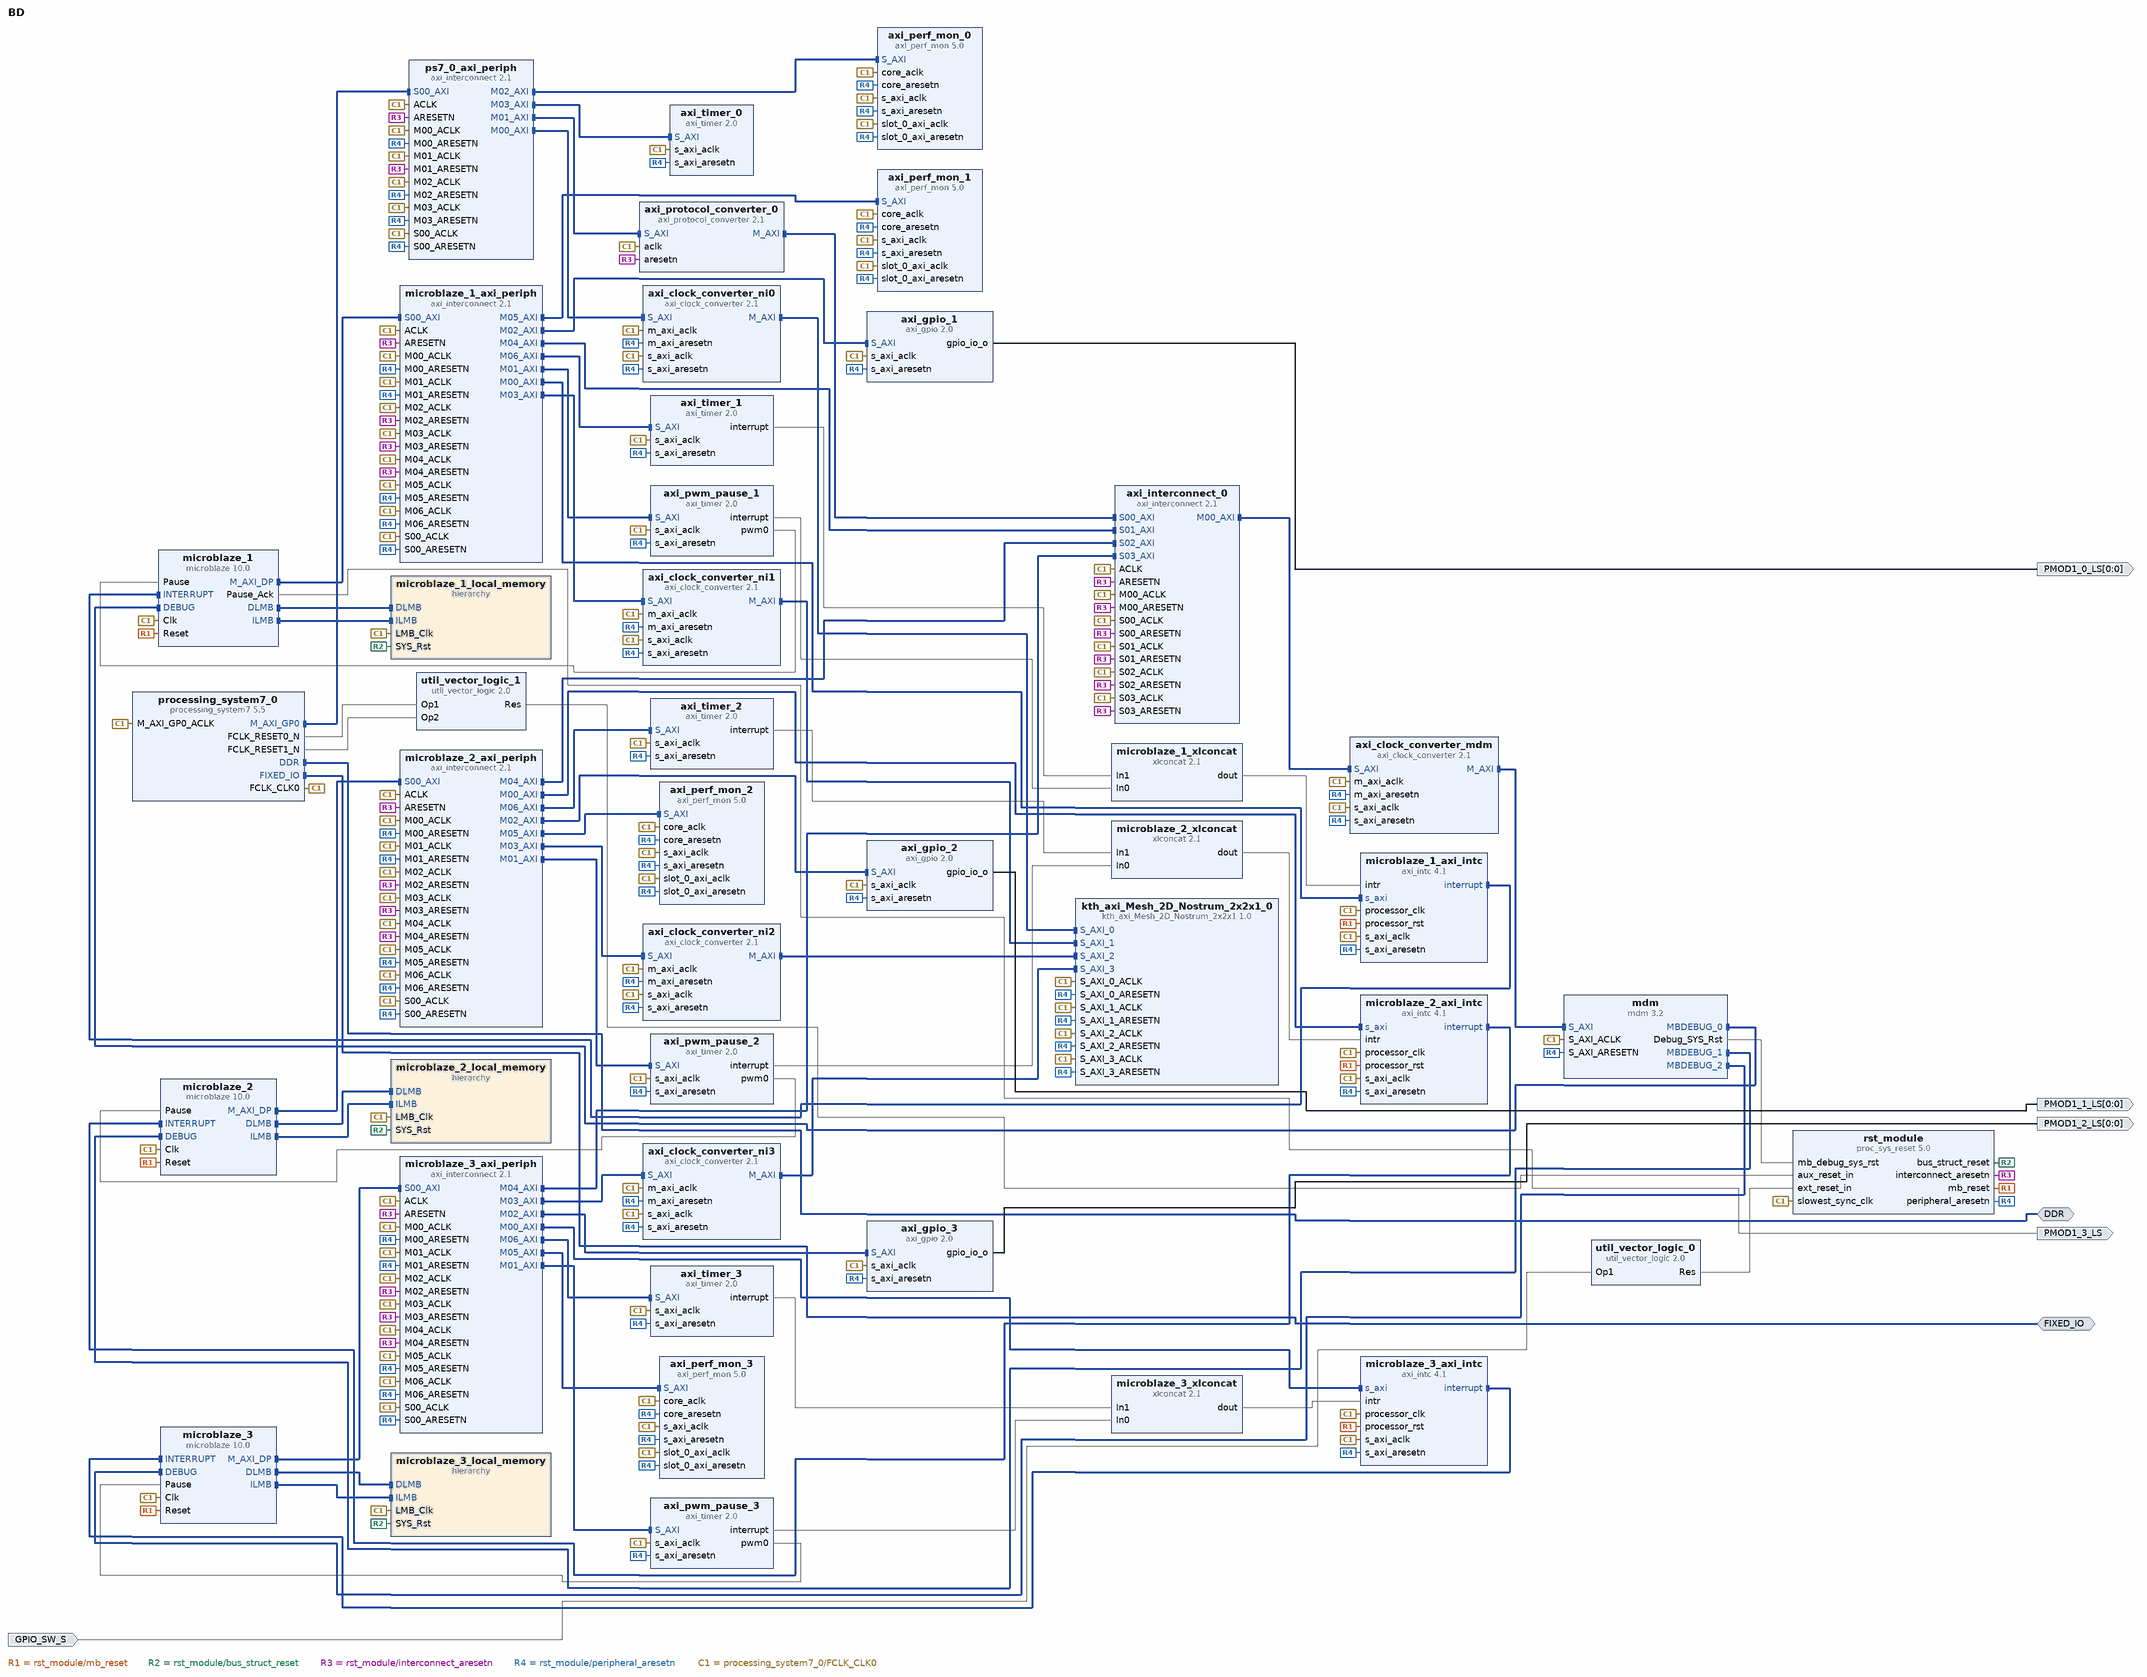
[diagram p0: block diagram of the top level]
# Vivado block design BD, xc7z020clg484-1, Vivado 2016.3
create_bd_design BD

create_bd_intf_port -mode Master -vlnv xilinx.com:interface:ddrx_rtl:1.0 DDR
create_bd_intf_port -mode Master -vlnv xilinx.com:display_processing_system7:fixedio_rtl:1.0 FIXED_IO
create_bd_port -dir O -from 0 -to 0 PMOD1_0_LS
create_bd_port -dir O -from 0 -to 0 PMOD1_1_LS
create_bd_port -dir O -from 0 -to 0 PMOD1_2_LS
create_bd_port -dir I GPIO_SW_S
create_bd_port -dir O PMOD1_3_LS

create_bd_cell -type ip -vlnv xilinx.com:ip:axi_gpio:2.0 axi_gpio_1
set_property -dict {CONFIG.C_GPIO_WIDTH 1 CONFIG.C_ALL_OUTPUTS 1} [get_bd_cells axi_gpio_1]
create_bd_cell -type ip -vlnv xilinx.com:ip:axi_gpio:2.0 axi_gpio_2
set_property -dict {CONFIG.C_GPIO_WIDTH 1 CONFIG.C_ALL_OUTPUTS 1} [get_bd_cells axi_gpio_2]
create_bd_cell -type ip -vlnv xilinx.com:ip:axi_gpio:2.0 axi_gpio_3
set_property -dict {CONFIG.C_GPIO_WIDTH 1 CONFIG.C_ALL_OUTPUTS 1} [get_bd_cells axi_gpio_3]
create_bd_cell -type ip -vlnv xilinx.com:ip:axi_timer:2.0 axi_pwm_pause_1
set_property -dict {CONFIG.mode_64bit 0} [get_bd_cells axi_pwm_pause_1]
create_bd_cell -type ip -vlnv xilinx.com:ip:axi_timer:2.0 axi_pwm_pause_2
set_property -dict {CONFIG.mode_64bit 0} [get_bd_cells axi_pwm_pause_2]
create_bd_cell -type ip -vlnv xilinx.com:ip:axi_timer:2.0 axi_pwm_pause_3
set_property -dict {CONFIG.mode_64bit 0} [get_bd_cells axi_pwm_pause_3]
create_bd_cell -type ip -vlnv xilinx.com:ip:microblaze:10.0 microblaze_1
set_property -dict [list \
  CONFIG.C_D_AXI 1 \
  CONFIG.C_D_LMB 1 \
  CONFIG.C_I_LMB 1 \
  CONFIG.C_ENABLE_DISCRETE_PORTS 1 \
  CONFIG.C_DEBUG_ENABLED 2 \
] [get_bd_cells microblaze_1]
create_bd_cell -type hier microblaze_1_local_memory
create_bd_cell -type ip -vlnv xilinx.com:ip:axi_interconnect:2.1 microblaze_1_axi_periph
set_property -dict {CONFIG.NUM_MI 7} [get_bd_cells microblaze_1_axi_periph]
create_bd_cell -type ip -vlnv xilinx.com:ip:axi_intc:4.1 microblaze_1_axi_intc
set_property -dict [list \
  CONFIG.C_HAS_FAST 1 \
  CONFIG.C_S_AXI_ACLK_FREQ_MHZ 100 \
  CONFIG.C_PROCESSOR_CLK_FREQ_MHZ 100 \
] [get_bd_cells microblaze_1_axi_intc]
create_bd_cell -type ip -vlnv xilinx.com:ip:xlconcat:2.1 microblaze_1_xlconcat
create_bd_cell -type ip -vlnv xilinx.com:ip:mdm:3.2 mdm
set_property -dict {CONFIG.C_MB_DBG_PORTS 3 CONFIG.C_USE_UART 1} [get_bd_cells mdm]
create_bd_cell -type ip -vlnv xilinx.com:ip:proc_sys_reset:5.0 rst_module
set_property -dict {CONFIG.C_AUX_RESET_HIGH 0} [get_bd_cells rst_module]
create_bd_cell -type ip -vlnv xilinx.com:ip:microblaze:10.0 microblaze_2
set_property -dict [list \
  CONFIG.C_D_AXI 1 \
  CONFIG.C_D_LMB 1 \
  CONFIG.C_I_LMB 1 \
  CONFIG.C_ENABLE_DISCRETE_PORTS 1 \
  CONFIG.C_DEBUG_ENABLED 2 \
] [get_bd_cells microblaze_2]
create_bd_cell -type hier microblaze_2_local_memory
create_bd_cell -type ip -vlnv xilinx.com:ip:axi_interconnect:2.1 microblaze_2_axi_periph
set_property -dict {CONFIG.NUM_MI 7} [get_bd_cells microblaze_2_axi_periph]
create_bd_cell -type ip -vlnv xilinx.com:ip:axi_intc:4.1 microblaze_2_axi_intc
set_property -dict [list \
  CONFIG.C_HAS_FAST 1 \
  CONFIG.C_S_AXI_ACLK_FREQ_MHZ 100 \
  CONFIG.C_PROCESSOR_CLK_FREQ_MHZ 100 \
] [get_bd_cells microblaze_2_axi_intc]
create_bd_cell -type ip -vlnv xilinx.com:ip:xlconcat:2.1 microblaze_2_xlconcat
create_bd_cell -type ip -vlnv xilinx.com:ip:microblaze:10.0 microblaze_3
set_property -dict [list \
  CONFIG.C_D_AXI 1 \
  CONFIG.C_D_LMB 1 \
  CONFIG.C_I_LMB 1 \
  CONFIG.C_ENABLE_DISCRETE_PORTS 1 \
  CONFIG.C_DEBUG_ENABLED 2 \
] [get_bd_cells microblaze_3]
create_bd_cell -type hier microblaze_3_local_memory
create_bd_cell -type ip -vlnv xilinx.com:ip:axi_interconnect:2.1 microblaze_3_axi_periph
set_property -dict {CONFIG.NUM_MI 7} [get_bd_cells microblaze_3_axi_periph]
create_bd_cell -type ip -vlnv xilinx.com:ip:axi_intc:4.1 microblaze_3_axi_intc
set_property -dict [list \
  CONFIG.C_HAS_FAST 1 \
  CONFIG.C_S_AXI_ACLK_FREQ_MHZ 100 \
  CONFIG.C_PROCESSOR_CLK_FREQ_MHZ 100 \
] [get_bd_cells microblaze_3_axi_intc]
create_bd_cell -type ip -vlnv xilinx.com:ip:xlconcat:2.1 microblaze_3_xlconcat
create_bd_cell -type ip -vlnv xilinx.com:ip:util_vector_logic:2.0 util_vector_logic_0
set_property -dict {CONFIG.C_SIZE 1 CONFIG.C_OPERATION not} [get_bd_cells util_vector_logic_0]
create_bd_cell -type ip -vlnv xilinx.com:ip:processing_system7:5.5 processing_system7_0
set_property -dict [list \
  CONFIG.PCW_FPGA0_PERIPHERAL_FREQMHZ 50 \
  CONFIG.PCW_FPGA1_PERIPHERAL_FREQMHZ 100 \
  CONFIG.PCW_EN_CLK1_PORT 1 \
  CONFIG.PCW_EN_CLK2_PORT 1 \
  CONFIG.PCW_EN_CLK3_PORT 1 \
  CONFIG.PCW_EN_RST1_PORT 1 \
  CONFIG.PCW_EN_RST2_PORT 1 \
  CONFIG.PCW_EN_RST3_PORT 1 \
  CONFIG.PCW_QSPI_GRP_SINGLE_SS_ENABLE 1 \
  CONFIG.PCW_USB0_PERIPHERAL_ENABLE 0 \
  CONFIG.preset ZC702 \
] [get_bd_cells processing_system7_0]
# 6 more settings of processing_system7_0 are not shown: defaults, MIO pin electricals, DDR timing, and values the tool derives
create_bd_cell -type ip -vlnv kth.se:tage:kth_axi_Mesh_2D_Nostrum_2x2x1:1.0 kth_axi_Mesh_2D_Nostrum_2x2x1_0
create_bd_cell -type ip -vlnv xilinx.com:ip:axi_interconnect:2.1 ps7_0_axi_periph
set_property -dict {CONFIG.NUM_MI 4} [get_bd_cells ps7_0_axi_periph]
create_bd_cell -type ip -vlnv xilinx.com:ip:axi_interconnect:2.1 axi_interconnect_0
set_property -dict [list \
  CONFIG.NUM_SI 4 \
  CONFIG.NUM_MI 1 \
  CONFIG.ENABLE_ADVANCED_OPTIONS 1 \
  CONFIG.M00_HAS_DATA_FIFO 1 \
  CONFIG.S00_HAS_REGSLICE 3 \
  CONFIG.S01_HAS_REGSLICE 3 \
  CONFIG.S02_HAS_REGSLICE 3 \
  CONFIG.S03_HAS_REGSLICE 3 \
  CONFIG.S00_HAS_DATA_FIFO 1 \
  CONFIG.S01_HAS_DATA_FIFO 1 \
  CONFIG.S02_HAS_DATA_FIFO 1 \
  CONFIG.S03_HAS_DATA_FIFO 1 \
] [get_bd_cells axi_interconnect_0]
create_bd_cell -type ip -vlnv xilinx.com:ip:axi_protocol_converter:2.1 axi_protocol_converter_0
create_bd_cell -type ip -vlnv xilinx.com:ip:axi_perf_mon:5.0 axi_perf_mon_0
set_property -dict [list \
  CONFIG.C_NUM_OF_COUNTERS 10 \
  CONFIG.C_ENABLE_EVENT_COUNT 1 \
  CONFIG.ENABLE_EXT_TRIGGERS 0 \
  CONFIG.C_ENABLE_ADVANCED 1 \
  CONFIG.C_ENABLE_PROFILE 0 \
] [get_bd_cells axi_perf_mon_0]
create_bd_cell -type ip -vlnv xilinx.com:ip:axi_perf_mon:5.0 axi_perf_mon_1
set_property -dict [list \
  CONFIG.C_NUM_OF_COUNTERS 10 \
  CONFIG.C_ENABLE_EVENT_COUNT 1 \
  CONFIG.ENABLE_EXT_TRIGGERS 0 \
  CONFIG.C_ENABLE_ADVANCED 1 \
  CONFIG.C_ENABLE_PROFILE 0 \
] [get_bd_cells axi_perf_mon_1]
create_bd_cell -type ip -vlnv xilinx.com:ip:axi_perf_mon:5.0 axi_perf_mon_2
set_property -dict [list \
  CONFIG.C_NUM_OF_COUNTERS 10 \
  CONFIG.C_ENABLE_EVENT_COUNT 1 \
  CONFIG.ENABLE_EXT_TRIGGERS 0 \
  CONFIG.C_ENABLE_ADVANCED 1 \
  CONFIG.C_ENABLE_PROFILE 0 \
] [get_bd_cells axi_perf_mon_2]
create_bd_cell -type ip -vlnv xilinx.com:ip:axi_perf_mon:5.0 axi_perf_mon_3
set_property -dict [list \
  CONFIG.C_NUM_OF_COUNTERS 10 \
  CONFIG.C_ENABLE_EVENT_COUNT 1 \
  CONFIG.ENABLE_EXT_TRIGGERS 0 \
  CONFIG.C_ENABLE_ADVANCED 1 \
  CONFIG.C_ENABLE_PROFILE 0 \
] [get_bd_cells axi_perf_mon_3]
create_bd_cell -type ip -vlnv xilinx.com:ip:axi_timer:2.0 axi_timer_0
create_bd_cell -type ip -vlnv xilinx.com:ip:axi_timer:2.0 axi_timer_1
create_bd_cell -type ip -vlnv xilinx.com:ip:axi_timer:2.0 axi_timer_2
create_bd_cell -type ip -vlnv xilinx.com:ip:axi_timer:2.0 axi_timer_3
create_bd_cell -type ip -vlnv xilinx.com:ip:axi_clock_converter:2.1 axi_clock_converter_mdm
set_property -dict {CONFIG.ACLK_ASYNC 1 CONFIG.SYNCHRONIZATION_STAGES 8} [get_bd_cells axi_clock_converter_mdm]
create_bd_cell -type ip -vlnv xilinx.com:ip:axi_clock_converter:2.1 axi_clock_converter_ni0
set_property -dict {CONFIG.ACLK_ASYNC 1 CONFIG.SYNCHRONIZATION_STAGES 8} [get_bd_cells axi_clock_converter_ni0]
create_bd_cell -type ip -vlnv xilinx.com:ip:axi_clock_converter:2.1 axi_clock_converter_ni1
set_property -dict {CONFIG.ACLK_ASYNC 1 CONFIG.SYNCHRONIZATION_STAGES 8} [get_bd_cells axi_clock_converter_ni1]
create_bd_cell -type ip -vlnv xilinx.com:ip:axi_clock_converter:2.1 axi_clock_converter_ni2
set_property -dict {CONFIG.ACLK_ASYNC 1 CONFIG.SYNCHRONIZATION_STAGES 8} [get_bd_cells axi_clock_converter_ni2]
create_bd_cell -type ip -vlnv xilinx.com:ip:axi_clock_converter:2.1 axi_clock_converter_ni3
set_property -dict {CONFIG.ACLK_ASYNC 1 CONFIG.SYNCHRONIZATION_STAGES 8} [get_bd_cells axi_clock_converter_ni3]
create_bd_cell -type ip -vlnv xilinx.com:ip:util_vector_logic:2.0 util_vector_logic_1
set_property -dict {CONFIG.C_OPERATION and} [get_bd_cells util_vector_logic_1]

# ---- hierarchy /microblaze_1_local_memory ----
current_bd_instance /microblaze_1_local_memory
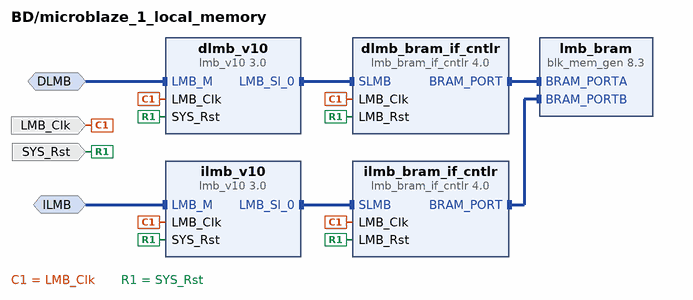
[diagram p1: block diagram inside /microblaze_1_local_memory]
create_bd_intf_pin -mode MirroredMaster -vlnv xilinx.com:interface:lmb_rtl:1.0 DLMB
create_bd_intf_pin -mode MirroredMaster -vlnv xilinx.com:interface:lmb_rtl:1.0 ILMB
create_bd_pin -dir I -type clk LMB_Clk
create_bd_pin -dir I -type rst SYS_Rst

create_bd_cell -type ip -vlnv xilinx.com:ip:lmb_v10:3.0 dlmb_v10
create_bd_cell -type ip -vlnv xilinx.com:ip:lmb_v10:3.0 ilmb_v10
create_bd_cell -type ip -vlnv xilinx.com:ip:lmb_bram_if_cntlr:4.0 dlmb_bram_if_cntlr
set_property -dict {CONFIG.C_ECC 0} [get_bd_cells dlmb_bram_if_cntlr]
create_bd_cell -type ip -vlnv xilinx.com:ip:lmb_bram_if_cntlr:4.0 ilmb_bram_if_cntlr
set_property -dict {CONFIG.C_ECC 0} [get_bd_cells ilmb_bram_if_cntlr]
create_bd_cell -type ip -vlnv xilinx.com:ip:blk_mem_gen:8.3 lmb_bram
set_property -dict {CONFIG.Memory_Type True_Dual_Port_RAM CONFIG.use_bram_block BRAM_Controller} [get_bd_cells lmb_bram]

# ---- hierarchy /microblaze_2_local_memory ----
current_bd_instance /microblaze_2_local_memory
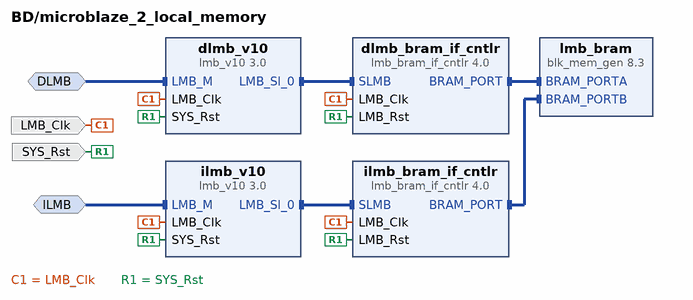
[diagram p2: block diagram inside /microblaze_2_local_memory]
create_bd_intf_pin -mode MirroredMaster -vlnv xilinx.com:interface:lmb_rtl:1.0 DLMB
create_bd_intf_pin -mode MirroredMaster -vlnv xilinx.com:interface:lmb_rtl:1.0 ILMB
create_bd_pin -dir I -type clk LMB_Clk
create_bd_pin -dir I -type rst SYS_Rst

create_bd_cell -type ip -vlnv xilinx.com:ip:lmb_v10:3.0 dlmb_v10
create_bd_cell -type ip -vlnv xilinx.com:ip:lmb_v10:3.0 ilmb_v10
create_bd_cell -type ip -vlnv xilinx.com:ip:lmb_bram_if_cntlr:4.0 dlmb_bram_if_cntlr
set_property -dict {CONFIG.C_ECC 0} [get_bd_cells dlmb_bram_if_cntlr]
create_bd_cell -type ip -vlnv xilinx.com:ip:lmb_bram_if_cntlr:4.0 ilmb_bram_if_cntlr
set_property -dict {CONFIG.C_ECC 0} [get_bd_cells ilmb_bram_if_cntlr]
create_bd_cell -type ip -vlnv xilinx.com:ip:blk_mem_gen:8.3 lmb_bram
set_property -dict {CONFIG.Memory_Type True_Dual_Port_RAM CONFIG.use_bram_block BRAM_Controller} [get_bd_cells lmb_bram]

# ---- hierarchy /microblaze_3_local_memory ----
current_bd_instance /microblaze_3_local_memory
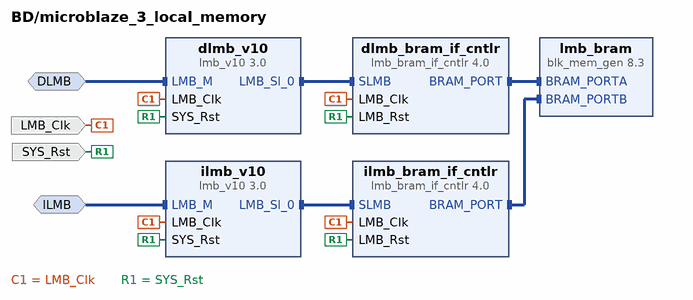
[diagram p3: block diagram inside /microblaze_3_local_memory]
create_bd_intf_pin -mode MirroredMaster -vlnv xilinx.com:interface:lmb_rtl:1.0 DLMB
create_bd_intf_pin -mode MirroredMaster -vlnv xilinx.com:interface:lmb_rtl:1.0 ILMB
create_bd_pin -dir I -type clk LMB_Clk
create_bd_pin -dir I -type rst SYS_Rst

create_bd_cell -type ip -vlnv xilinx.com:ip:lmb_v10:3.0 dlmb_v10
create_bd_cell -type ip -vlnv xilinx.com:ip:lmb_v10:3.0 ilmb_v10
create_bd_cell -type ip -vlnv xilinx.com:ip:lmb_bram_if_cntlr:4.0 dlmb_bram_if_cntlr
set_property -dict {CONFIG.C_ECC 0} [get_bd_cells dlmb_bram_if_cntlr]
create_bd_cell -type ip -vlnv xilinx.com:ip:lmb_bram_if_cntlr:4.0 ilmb_bram_if_cntlr
set_property -dict {CONFIG.C_ECC 0} [get_bd_cells ilmb_bram_if_cntlr]
create_bd_cell -type ip -vlnv xilinx.com:ip:blk_mem_gen:8.3 lmb_bram
set_property -dict {CONFIG.Memory_Type True_Dual_Port_RAM CONFIG.use_bram_block BRAM_Controller} [get_bd_cells lmb_bram]

# ---- connections ----

current_bd_instance /microblaze_1_local_memory
connect_bd_intf_net [get_bd_intf_pins dlmb_v10/LMB_Sl_0] [get_bd_intf_pins dlmb_bram_if_cntlr/SLMB]
connect_bd_intf_net [get_bd_intf_pins ilmb_v10/LMB_Sl_0] [get_bd_intf_pins ilmb_bram_if_cntlr/SLMB]
connect_bd_intf_net [get_bd_intf_pins dlmb_bram_if_cntlr/BRAM_PORT] [get_bd_intf_pins lmb_bram/BRAM_PORTA]
connect_bd_intf_net [get_bd_intf_pins ilmb_bram_if_cntlr/BRAM_PORT] [get_bd_intf_pins lmb_bram/BRAM_PORTB]
connect_bd_intf_net [get_bd_intf_pins DLMB] [get_bd_intf_pins dlmb_v10/LMB_M]
connect_bd_intf_net [get_bd_intf_pins ILMB] [get_bd_intf_pins ilmb_v10/LMB_M]
connect_bd_net -net microblaze_1_Clk [get_bd_pins LMB_Clk] \
  [get_bd_pins dlmb_v10/LMB_Clk] [get_bd_pins dlmb_bram_if_cntlr/LMB_Clk] [get_bd_pins ilmb_v10/LMB_Clk] \
  [get_bd_pins ilmb_bram_if_cntlr/LMB_Clk]
connect_bd_net [get_bd_pins SYS_Rst] \
  [get_bd_pins dlmb_v10/SYS_Rst] [get_bd_pins dlmb_bram_if_cntlr/LMB_Rst] [get_bd_pins ilmb_v10/SYS_Rst] \
  [get_bd_pins ilmb_bram_if_cntlr/LMB_Rst]

current_bd_instance /microblaze_2_local_memory
connect_bd_intf_net [get_bd_intf_pins dlmb_v10/LMB_Sl_0] [get_bd_intf_pins dlmb_bram_if_cntlr/SLMB]
connect_bd_intf_net [get_bd_intf_pins ilmb_v10/LMB_Sl_0] [get_bd_intf_pins ilmb_bram_if_cntlr/SLMB]
connect_bd_intf_net [get_bd_intf_pins dlmb_bram_if_cntlr/BRAM_PORT] [get_bd_intf_pins lmb_bram/BRAM_PORTA]
connect_bd_intf_net [get_bd_intf_pins ilmb_bram_if_cntlr/BRAM_PORT] [get_bd_intf_pins lmb_bram/BRAM_PORTB]
connect_bd_intf_net [get_bd_intf_pins DLMB] [get_bd_intf_pins dlmb_v10/LMB_M]
connect_bd_intf_net [get_bd_intf_pins ILMB] [get_bd_intf_pins ilmb_v10/LMB_M]
connect_bd_net -net microblaze_2_Clk [get_bd_pins LMB_Clk] \
  [get_bd_pins dlmb_v10/LMB_Clk] [get_bd_pins dlmb_bram_if_cntlr/LMB_Clk] [get_bd_pins ilmb_v10/LMB_Clk] \
  [get_bd_pins ilmb_bram_if_cntlr/LMB_Clk]
connect_bd_net [get_bd_pins SYS_Rst] \
  [get_bd_pins dlmb_v10/SYS_Rst] [get_bd_pins dlmb_bram_if_cntlr/LMB_Rst] [get_bd_pins ilmb_v10/SYS_Rst] \
  [get_bd_pins ilmb_bram_if_cntlr/LMB_Rst]

current_bd_instance /microblaze_3_local_memory
connect_bd_intf_net [get_bd_intf_pins dlmb_v10/LMB_Sl_0] [get_bd_intf_pins dlmb_bram_if_cntlr/SLMB]
connect_bd_intf_net [get_bd_intf_pins ilmb_v10/LMB_Sl_0] [get_bd_intf_pins ilmb_bram_if_cntlr/SLMB]
connect_bd_intf_net [get_bd_intf_pins dlmb_bram_if_cntlr/BRAM_PORT] [get_bd_intf_pins lmb_bram/BRAM_PORTA]
connect_bd_intf_net [get_bd_intf_pins ilmb_bram_if_cntlr/BRAM_PORT] [get_bd_intf_pins lmb_bram/BRAM_PORTB]
connect_bd_intf_net [get_bd_intf_pins DLMB] [get_bd_intf_pins dlmb_v10/LMB_M]
connect_bd_intf_net [get_bd_intf_pins ILMB] [get_bd_intf_pins ilmb_v10/LMB_M]
connect_bd_net -net microblaze_3_Clk [get_bd_pins LMB_Clk] \
  [get_bd_pins dlmb_v10/LMB_Clk] [get_bd_pins dlmb_bram_if_cntlr/LMB_Clk] [get_bd_pins ilmb_v10/LMB_Clk] \
  [get_bd_pins ilmb_bram_if_cntlr/LMB_Clk]
connect_bd_net [get_bd_pins SYS_Rst] \
  [get_bd_pins dlmb_v10/SYS_Rst] [get_bd_pins dlmb_bram_if_cntlr/LMB_Rst] [get_bd_pins ilmb_v10/SYS_Rst] \
  [get_bd_pins ilmb_bram_if_cntlr/LMB_Rst]

current_bd_instance /
connect_bd_intf_net [get_bd_intf_pins microblaze_1/DLMB] [get_bd_intf_pins microblaze_1_local_memory/DLMB]
connect_bd_intf_net [get_bd_intf_pins microblaze_1/ILMB] [get_bd_intf_pins microblaze_1_local_memory/ILMB]
connect_bd_intf_net [get_bd_intf_pins microblaze_1_axi_periph/S00_AXI] [get_bd_intf_pins microblaze_1/M_AXI_DP]
connect_bd_intf_net [get_bd_intf_pins microblaze_1_axi_intc/interrupt] [get_bd_intf_pins microblaze_1/INTERRUPT]
connect_bd_intf_net [get_bd_intf_pins microblaze_1_axi_periph/M00_AXI] [get_bd_intf_pins microblaze_1_axi_intc/s_axi]
connect_bd_intf_net [get_bd_intf_pins mdm/MBDEBUG_0] [get_bd_intf_pins microblaze_1/DEBUG]
connect_bd_intf_net [get_bd_intf_pins microblaze_2/DLMB] [get_bd_intf_pins microblaze_2_local_memory/DLMB]
connect_bd_intf_net [get_bd_intf_pins microblaze_2/ILMB] [get_bd_intf_pins microblaze_2_local_memory/ILMB]
connect_bd_intf_net [get_bd_intf_pins microblaze_2_axi_periph/S00_AXI] [get_bd_intf_pins microblaze_2/M_AXI_DP]
connect_bd_intf_net [get_bd_intf_pins microblaze_2_axi_intc/interrupt] [get_bd_intf_pins microblaze_2/INTERRUPT]
connect_bd_intf_net [get_bd_intf_pins microblaze_2_axi_periph/M00_AXI] [get_bd_intf_pins microblaze_2_axi_intc/s_axi]
connect_bd_intf_net [get_bd_intf_pins mdm/MBDEBUG_1] [get_bd_intf_pins microblaze_2/DEBUG]
connect_bd_intf_net [get_bd_intf_pins microblaze_3/DLMB] [get_bd_intf_pins microblaze_3_local_memory/DLMB]
connect_bd_intf_net [get_bd_intf_pins microblaze_3/ILMB] [get_bd_intf_pins microblaze_3_local_memory/ILMB]
connect_bd_intf_net [get_bd_intf_pins microblaze_3_axi_periph/S00_AXI] [get_bd_intf_pins microblaze_3/M_AXI_DP]
connect_bd_intf_net [get_bd_intf_pins microblaze_3_axi_intc/interrupt] [get_bd_intf_pins microblaze_3/INTERRUPT]
connect_bd_intf_net [get_bd_intf_pins microblaze_3_axi_periph/M00_AXI] [get_bd_intf_pins microblaze_3_axi_intc/s_axi]
connect_bd_intf_net [get_bd_intf_pins mdm/MBDEBUG_2] [get_bd_intf_pins microblaze_3/DEBUG]
connect_bd_intf_net [get_bd_intf_pins microblaze_1_axi_periph/M01_AXI] [get_bd_intf_pins axi_pwm_pause_1/S_AXI]
connect_bd_intf_net [get_bd_intf_pins microblaze_1_axi_periph/M02_AXI] [get_bd_intf_pins axi_gpio_1/S_AXI]
connect_bd_intf_net [get_bd_intf_pins microblaze_2_axi_periph/M01_AXI] [get_bd_intf_pins axi_pwm_pause_2/S_AXI]
connect_bd_intf_net [get_bd_intf_pins microblaze_2_axi_periph/M02_AXI] [get_bd_intf_pins axi_gpio_2/S_AXI]
connect_bd_intf_net [get_bd_intf_pins microblaze_3_axi_periph/M01_AXI] [get_bd_intf_pins axi_pwm_pause_3/S_AXI]
connect_bd_intf_net [get_bd_intf_pins microblaze_3_axi_periph/M02_AXI] [get_bd_intf_pins axi_gpio_3/S_AXI]
connect_bd_intf_net [get_bd_intf_pins processing_system7_0/M_AXI_GP0] [get_bd_intf_pins ps7_0_axi_periph/S00_AXI]
connect_bd_intf_net [get_bd_intf_pins ps7_0_axi_periph/M01_AXI] [get_bd_intf_pins axi_protocol_converter_0/S_AXI]
connect_bd_intf_net [get_bd_intf_pins axi_protocol_converter_0/M_AXI] [get_bd_intf_pins axi_interconnect_0/S00_AXI]
connect_bd_intf_net [get_bd_intf_pins microblaze_1_axi_periph/M04_AXI] [get_bd_intf_pins axi_interconnect_0/S01_AXI]
connect_bd_intf_net [get_bd_intf_pins microblaze_2_axi_periph/M04_AXI] [get_bd_intf_pins axi_interconnect_0/S02_AXI]
connect_bd_intf_net [get_bd_intf_pins microblaze_3_axi_periph/M04_AXI] [get_bd_intf_pins axi_interconnect_0/S03_AXI]
connect_bd_intf_net [get_bd_intf_pins ps7_0_axi_periph/M02_AXI] [get_bd_intf_pins axi_perf_mon_0/S_AXI]
connect_bd_intf_net [get_bd_intf_pins microblaze_1_axi_periph/M05_AXI] [get_bd_intf_pins axi_perf_mon_1/S_AXI]
connect_bd_intf_net [get_bd_intf_pins microblaze_2_axi_periph/M05_AXI] [get_bd_intf_pins axi_perf_mon_2/S_AXI]
connect_bd_intf_net [get_bd_intf_pins microblaze_3_axi_periph/M05_AXI] [get_bd_intf_pins axi_perf_mon_3/S_AXI]
connect_bd_intf_net [get_bd_intf_pins ps7_0_axi_periph/M03_AXI] [get_bd_intf_pins axi_timer_0/S_AXI]
connect_bd_intf_net [get_bd_intf_pins microblaze_1_axi_periph/M06_AXI] [get_bd_intf_pins axi_timer_1/S_AXI]
connect_bd_intf_net [get_bd_intf_pins microblaze_2_axi_periph/M06_AXI] [get_bd_intf_pins axi_timer_2/S_AXI]
connect_bd_intf_net [get_bd_intf_pins microblaze_3_axi_periph/M06_AXI] [get_bd_intf_pins axi_timer_3/S_AXI]
connect_bd_intf_net [get_bd_intf_pins axi_interconnect_0/M00_AXI] [get_bd_intf_pins axi_clock_converter_mdm/S_AXI]
connect_bd_intf_net [get_bd_intf_pins ps7_0_axi_periph/M00_AXI] [get_bd_intf_pins axi_clock_converter_ni0/S_AXI]
connect_bd_intf_net [get_bd_intf_pins microblaze_1_axi_periph/M03_AXI] [get_bd_intf_pins axi_clock_converter_ni1/S_AXI]
connect_bd_intf_net [get_bd_intf_pins microblaze_2_axi_periph/M03_AXI] [get_bd_intf_pins axi_clock_converter_ni2/S_AXI]
connect_bd_intf_net [get_bd_intf_pins microblaze_3_axi_periph/M03_AXI] [get_bd_intf_pins axi_clock_converter_ni3/S_AXI]
connect_bd_intf_net [get_bd_intf_pins axi_clock_converter_mdm/M_AXI] [get_bd_intf_pins mdm/S_AXI]
connect_bd_intf_net [get_bd_intf_pins axi_clock_converter_ni0/M_AXI] [get_bd_intf_pins kth_axi_Mesh_2D_Nostrum_2x2x1_0/S_AXI_0]
connect_bd_intf_net [get_bd_intf_pins axi_clock_converter_ni1/M_AXI] [get_bd_intf_pins kth_axi_Mesh_2D_Nostrum_2x2x1_0/S_AXI_1]
connect_bd_intf_net [get_bd_intf_pins axi_clock_converter_ni2/M_AXI] [get_bd_intf_pins kth_axi_Mesh_2D_Nostrum_2x2x1_0/S_AXI_2]
connect_bd_intf_net [get_bd_intf_pins axi_clock_converter_ni3/M_AXI] [get_bd_intf_pins kth_axi_Mesh_2D_Nostrum_2x2x1_0/S_AXI_3]
connect_bd_intf_net [get_bd_intf_ports DDR] [get_bd_intf_pins processing_system7_0/DDR]
connect_bd_intf_net [get_bd_intf_ports FIXED_IO] [get_bd_intf_pins processing_system7_0/FIXED_IO]
connect_bd_net [get_bd_pins axi_gpio_1/gpio_io_o] [get_bd_ports PMOD1_0_LS]
connect_bd_net [get_bd_pins axi_gpio_2/gpio_io_o] [get_bd_ports PMOD1_1_LS]
connect_bd_net [get_bd_pins axi_gpio_3/gpio_io_o] [get_bd_ports PMOD1_2_LS]
connect_bd_net -net microblaze_1_intr [get_bd_pins microblaze_1_xlconcat/dout] [get_bd_pins microblaze_1_axi_intc/intr]
connect_bd_net -net rst_clk_wiz_0_100M_mb_reset [get_bd_pins rst_module/mb_reset] \
  [get_bd_pins microblaze_1/Reset] [get_bd_pins microblaze_1_axi_intc/processor_rst] [get_bd_pins microblaze_2/Reset] \
  [get_bd_pins microblaze_2_axi_intc/processor_rst] [get_bd_pins microblaze_3/Reset] \
  [get_bd_pins microblaze_3_axi_intc/processor_rst]
connect_bd_net -net rst_clk_wiz_0_100M_bus_struct_reset [get_bd_pins rst_module/bus_struct_reset] \
  [get_bd_pins microblaze_1_local_memory/SYS_Rst] [get_bd_pins microblaze_2_local_memory/SYS_Rst] \
  [get_bd_pins microblaze_3_local_memory/SYS_Rst]
connect_bd_net -net rst_clk_wiz_0_100M_interconnect_aresetn [get_bd_pins rst_module/interconnect_aresetn] \
  [get_bd_pins microblaze_1_axi_periph/ARESETN] [get_bd_pins microblaze_2_axi_periph/ARESETN] \
  [get_bd_pins microblaze_3_axi_periph/ARESETN] [get_bd_pins microblaze_1_axi_periph/M02_ARESETN] \
  [get_bd_pins microblaze_1_axi_periph/M03_ARESETN] [get_bd_pins microblaze_2_axi_periph/M02_ARESETN] \
  [get_bd_pins microblaze_2_axi_periph/M03_ARESETN] [get_bd_pins microblaze_3_axi_periph/M02_ARESETN] \
  [get_bd_pins microblaze_3_axi_periph/M03_ARESETN] [get_bd_pins ps7_0_axi_periph/ARESETN] \
  [get_bd_pins ps7_0_axi_periph/M01_ARESETN] [get_bd_pins axi_protocol_converter_0/aresetn] \
  [get_bd_pins microblaze_1_axi_periph/M04_ARESETN] [get_bd_pins microblaze_2_axi_periph/M04_ARESETN] \
  [get_bd_pins microblaze_3_axi_periph/M04_ARESETN] [get_bd_pins axi_interconnect_0/ARESETN] \
  [get_bd_pins axi_interconnect_0/S00_ARESETN] [get_bd_pins axi_interconnect_0/S01_ARESETN] \
  [get_bd_pins axi_interconnect_0/S02_ARESETN] [get_bd_pins axi_interconnect_0/S03_ARESETN] \
  [get_bd_pins axi_interconnect_0/M00_ARESETN]
connect_bd_net -net rst_clk_wiz_0_100M_peripheral_aresetn [get_bd_pins rst_module/peripheral_aresetn] \
  [get_bd_pins microblaze_1_axi_periph/S00_ARESETN] [get_bd_pins microblaze_1_axi_periph/M00_ARESETN] \
  [get_bd_pins microblaze_1_axi_intc/s_axi_aresetn] [get_bd_pins microblaze_2_axi_periph/S00_ARESETN] \
  [get_bd_pins microblaze_2_axi_periph/M00_ARESETN] [get_bd_pins microblaze_2_axi_intc/s_axi_aresetn] \
  [get_bd_pins microblaze_3_axi_periph/S00_ARESETN] [get_bd_pins microblaze_3_axi_periph/M00_ARESETN] \
  [get_bd_pins microblaze_3_axi_intc/s_axi_aresetn] [get_bd_pins axi_pwm_pause_1/s_axi_aresetn] \
  [get_bd_pins microblaze_1_axi_periph/M01_ARESETN] [get_bd_pins axi_gpio_1/s_axi_aresetn] \
  [get_bd_pins kth_axi_Mesh_2D_Nostrum_2x2x1_0/S_AXI_1_ARESETN] [get_bd_pins axi_pwm_pause_2/s_axi_aresetn] \
  [get_bd_pins microblaze_2_axi_periph/M01_ARESETN] [get_bd_pins axi_gpio_2/s_axi_aresetn] \
  [get_bd_pins kth_axi_Mesh_2D_Nostrum_2x2x1_0/S_AXI_2_ARESETN] [get_bd_pins axi_pwm_pause_3/s_axi_aresetn] \
  [get_bd_pins microblaze_3_axi_periph/M01_ARESETN] [get_bd_pins axi_gpio_3/s_axi_aresetn] \
  [get_bd_pins kth_axi_Mesh_2D_Nostrum_2x2x1_0/S_AXI_3_ARESETN] [get_bd_pins ps7_0_axi_periph/S00_ARESETN] \
  [get_bd_pins kth_axi_Mesh_2D_Nostrum_2x2x1_0/S_AXI_0_ARESETN] [get_bd_pins ps7_0_axi_periph/M00_ARESETN] \
  [get_bd_pins mdm/S_AXI_ARESETN] [get_bd_pins axi_perf_mon_0/s_axi_aresetn] [get_bd_pins ps7_0_axi_periph/M02_ARESETN] \
  [get_bd_pins axi_perf_mon_1/s_axi_aresetn] [get_bd_pins microblaze_1_axi_periph/M05_ARESETN] \
  [get_bd_pins axi_perf_mon_2/s_axi_aresetn] [get_bd_pins microblaze_2_axi_periph/M05_ARESETN] \
  [get_bd_pins axi_perf_mon_3/s_axi_aresetn] [get_bd_pins microblaze_3_axi_periph/M05_ARESETN] \
  [get_bd_pins axi_perf_mon_0/core_aresetn] [get_bd_pins axi_perf_mon_0/slot_0_axi_aresetn] \
  [get_bd_pins axi_perf_mon_1/core_aresetn] [get_bd_pins axi_perf_mon_1/slot_0_axi_aresetn] \
  [get_bd_pins axi_perf_mon_2/core_aresetn] [get_bd_pins axi_perf_mon_2/slot_0_axi_aresetn] \
  [get_bd_pins axi_perf_mon_3/core_aresetn] [get_bd_pins axi_perf_mon_3/slot_0_axi_aresetn] \
  [get_bd_pins axi_timer_0/s_axi_aresetn] [get_bd_pins ps7_0_axi_periph/M03_ARESETN] [get_bd_pins axi_timer_1/s_axi_aresetn] \
  [get_bd_pins microblaze_1_axi_periph/M06_ARESETN] [get_bd_pins axi_timer_2/s_axi_aresetn] \
  [get_bd_pins microblaze_2_axi_periph/M06_ARESETN] [get_bd_pins axi_timer_3/s_axi_aresetn] \
  [get_bd_pins microblaze_3_axi_periph/M06_ARESETN] [get_bd_pins axi_clock_converter_mdm/s_axi_aresetn] \
  [get_bd_pins axi_clock_converter_ni0/s_axi_aresetn] [get_bd_pins axi_clock_converter_ni1/s_axi_aresetn] \
  [get_bd_pins axi_clock_converter_ni2/s_axi_aresetn] [get_bd_pins axi_clock_converter_ni3/s_axi_aresetn] \
  [get_bd_pins axi_clock_converter_mdm/m_axi_aresetn] [get_bd_pins axi_clock_converter_ni0/m_axi_aresetn] \
  [get_bd_pins axi_clock_converter_ni1/m_axi_aresetn] [get_bd_pins axi_clock_converter_ni2/m_axi_aresetn] \
  [get_bd_pins axi_clock_converter_ni3/m_axi_aresetn]
connect_bd_net -net mdm_1_debug_sys_rst [get_bd_pins mdm/Debug_SYS_Rst] [get_bd_pins rst_module/mb_debug_sys_rst]
connect_bd_net -net microblaze_2_intr [get_bd_pins microblaze_2_xlconcat/dout] [get_bd_pins microblaze_2_axi_intc/intr]
connect_bd_net -net microblaze_3_intr [get_bd_pins microblaze_3_xlconcat/dout] [get_bd_pins microblaze_3_axi_intc/intr]
connect_bd_net [get_bd_ports GPIO_SW_S] [get_bd_pins util_vector_logic_0/Op1]
connect_bd_net [get_bd_pins util_vector_logic_0/Res] [get_bd_pins rst_module/ext_reset_in]
connect_bd_net [get_bd_pins axi_pwm_pause_1/interrupt] [get_bd_pins microblaze_1_xlconcat/In0]
connect_bd_net [get_bd_pins axi_pwm_pause_2/interrupt] [get_bd_pins microblaze_2_xlconcat/In0]
connect_bd_net [get_bd_pins axi_pwm_pause_3/interrupt] [get_bd_pins microblaze_3_xlconcat/In0]
connect_bd_net [get_bd_pins axi_pwm_pause_1/pwm0] [get_bd_pins microblaze_1/Pause]
connect_bd_net [get_bd_pins axi_pwm_pause_2/pwm0] [get_bd_pins microblaze_2/Pause]
connect_bd_net [get_bd_pins axi_pwm_pause_3/pwm0] [get_bd_pins microblaze_3/Pause]
connect_bd_net [get_bd_pins microblaze_1/Pause_Ack] [get_bd_ports PMOD1_3_LS]
connect_bd_net [get_bd_pins axi_timer_1/interrupt] [get_bd_pins microblaze_1_xlconcat/In1]
connect_bd_net [get_bd_pins axi_timer_2/interrupt] [get_bd_pins microblaze_2_xlconcat/In1]
connect_bd_net [get_bd_pins axi_timer_3/interrupt] [get_bd_pins microblaze_3_xlconcat/In1]
connect_bd_net [get_bd_pins processing_system7_0/FCLK_CLK0] \
  [get_bd_pins rst_module/slowest_sync_clk] [get_bd_pins mdm/S_AXI_ACLK] \
  [get_bd_pins kth_axi_Mesh_2D_Nostrum_2x2x1_0/S_AXI_0_ACLK] [get_bd_pins kth_axi_Mesh_2D_Nostrum_2x2x1_0/S_AXI_1_ACLK] \
  [get_bd_pins kth_axi_Mesh_2D_Nostrum_2x2x1_0/S_AXI_2_ACLK] [get_bd_pins kth_axi_Mesh_2D_Nostrum_2x2x1_0/S_AXI_3_ACLK] \
  [get_bd_pins axi_clock_converter_mdm/m_axi_aclk] [get_bd_pins axi_clock_converter_ni0/m_axi_aclk] \
  [get_bd_pins axi_clock_converter_ni1/m_axi_aclk] [get_bd_pins axi_clock_converter_ni2/m_axi_aclk] \
  [get_bd_pins axi_clock_converter_ni3/m_axi_aclk] [get_bd_pins microblaze_1/Clk] [get_bd_pins microblaze_1_axi_periph/ACLK] \
  [get_bd_pins microblaze_1_axi_periph/S00_ACLK] [get_bd_pins microblaze_1_axi_periph/M00_ACLK] \
  [get_bd_pins microblaze_1_axi_intc/s_axi_aclk] [get_bd_pins microblaze_1_axi_intc/processor_clk] \
  [get_bd_pins microblaze_1_local_memory/LMB_Clk] [get_bd_pins microblaze_2/Clk] [get_bd_pins microblaze_2_axi_periph/ACLK] \
  [get_bd_pins microblaze_2_axi_periph/S00_ACLK] [get_bd_pins microblaze_2_axi_periph/M00_ACLK] \
  [get_bd_pins microblaze_2_axi_intc/s_axi_aclk] [get_bd_pins microblaze_2_axi_intc/processor_clk] \
  [get_bd_pins microblaze_2_local_memory/LMB_Clk] [get_bd_pins microblaze_3/Clk] [get_bd_pins microblaze_3_axi_periph/ACLK] \
  [get_bd_pins microblaze_3_axi_periph/S00_ACLK] [get_bd_pins microblaze_3_axi_periph/M00_ACLK] \
  [get_bd_pins microblaze_3_axi_intc/s_axi_aclk] [get_bd_pins microblaze_3_axi_intc/processor_clk] \
  [get_bd_pins microblaze_3_local_memory/LMB_Clk] [get_bd_pins axi_pwm_pause_1/s_axi_aclk] \
  [get_bd_pins microblaze_1_axi_periph/M01_ACLK] [get_bd_pins microblaze_1_axi_periph/M02_ACLK] \
  [get_bd_pins axi_gpio_1/s_axi_aclk] [get_bd_pins microblaze_1_axi_periph/M03_ACLK] [get_bd_pins axi_pwm_pause_2/s_axi_aclk] \
  [get_bd_pins microblaze_2_axi_periph/M01_ACLK] [get_bd_pins microblaze_2_axi_periph/M02_ACLK] \
  [get_bd_pins axi_gpio_2/s_axi_aclk] [get_bd_pins microblaze_2_axi_periph/M03_ACLK] [get_bd_pins axi_pwm_pause_3/s_axi_aclk] \
  [get_bd_pins microblaze_3_axi_periph/M01_ACLK] [get_bd_pins microblaze_3_axi_periph/M02_ACLK] \
  [get_bd_pins axi_gpio_3/s_axi_aclk] [get_bd_pins microblaze_3_axi_periph/M03_ACLK] \
  [get_bd_pins processing_system7_0/M_AXI_GP0_ACLK] [get_bd_pins ps7_0_axi_periph/S00_ACLK] \
  [get_bd_pins ps7_0_axi_periph/ACLK] [get_bd_pins ps7_0_axi_periph/M00_ACLK] [get_bd_pins ps7_0_axi_periph/M01_ACLK] \
  [get_bd_pins axi_protocol_converter_0/aclk] [get_bd_pins microblaze_1_axi_periph/M04_ACLK] \
  [get_bd_pins microblaze_2_axi_periph/M04_ACLK] [get_bd_pins microblaze_3_axi_periph/M04_ACLK] \
  [get_bd_pins axi_interconnect_0/ACLK] [get_bd_pins axi_interconnect_0/S00_ACLK] [get_bd_pins axi_interconnect_0/S01_ACLK] \
  [get_bd_pins axi_interconnect_0/S02_ACLK] [get_bd_pins axi_interconnect_0/S03_ACLK] \
  [get_bd_pins axi_interconnect_0/M00_ACLK] [get_bd_pins axi_perf_mon_0/s_axi_aclk] [get_bd_pins ps7_0_axi_periph/M02_ACLK] \
  [get_bd_pins axi_perf_mon_1/s_axi_aclk] [get_bd_pins microblaze_1_axi_periph/M05_ACLK] \
  [get_bd_pins axi_perf_mon_2/s_axi_aclk] [get_bd_pins microblaze_2_axi_periph/M05_ACLK] \
  [get_bd_pins axi_perf_mon_3/s_axi_aclk] [get_bd_pins microblaze_3_axi_periph/M05_ACLK] \
  [get_bd_pins axi_perf_mon_0/slot_0_axi_aclk] [get_bd_pins axi_perf_mon_0/core_aclk] \
  [get_bd_pins axi_perf_mon_1/slot_0_axi_aclk] [get_bd_pins axi_perf_mon_1/core_aclk] \
  [get_bd_pins axi_perf_mon_2/slot_0_axi_aclk] [get_bd_pins axi_perf_mon_2/core_aclk] \
  [get_bd_pins axi_perf_mon_3/slot_0_axi_aclk] [get_bd_pins axi_perf_mon_3/core_aclk] [get_bd_pins axi_timer_0/s_axi_aclk] \
  [get_bd_pins ps7_0_axi_periph/M03_ACLK] [get_bd_pins axi_timer_1/s_axi_aclk] [get_bd_pins microblaze_1_axi_periph/M06_ACLK] \
  [get_bd_pins axi_timer_2/s_axi_aclk] [get_bd_pins microblaze_2_axi_periph/M06_ACLK] [get_bd_pins axi_timer_3/s_axi_aclk] \
  [get_bd_pins microblaze_3_axi_periph/M06_ACLK] [get_bd_pins axi_clock_converter_mdm/s_axi_aclk] \
  [get_bd_pins axi_clock_converter_ni0/s_axi_aclk] [get_bd_pins axi_clock_converter_ni1/s_axi_aclk] \
  [get_bd_pins axi_clock_converter_ni2/s_axi_aclk] [get_bd_pins axi_clock_converter_ni3/s_axi_aclk]
connect_bd_net [get_bd_pins processing_system7_0/FCLK_RESET0_N] [get_bd_pins util_vector_logic_1/Op1]
connect_bd_net [get_bd_pins processing_system7_0/FCLK_RESET1_N] [get_bd_pins util_vector_logic_1/Op2]
connect_bd_net [get_bd_pins util_vector_logic_1/Res] [get_bd_pins rst_module/aux_reset_in]

# ---- address map ----
assign_bd_address -offset 0x00000000 -range 128K -target_address_space [get_bd_addr_spaces microblaze_1/Data] [get_bd_addr_segs microblaze_1_local_memory/dlmb_bram_if_cntlr/SLMB/Mem]
assign_bd_address -offset 0x40000000 -range 64K -target_address_space [get_bd_addr_spaces microblaze_1/Data] [get_bd_addr_segs axi_gpio_1/S_AXI/Reg]
assign_bd_address -offset 0x41200000 -range 64K -target_address_space [get_bd_addr_spaces microblaze_1/Data] [get_bd_addr_segs microblaze_1_axi_intc/S_AXI/Reg]
assign_bd_address -offset 0x41C00000 -range 64K -target_address_space [get_bd_addr_spaces microblaze_1/Data] [get_bd_addr_segs axi_pwm_pause_1/S_AXI/Reg]
assign_bd_address -offset 0x41C10000 -range 64K -target_address_space [get_bd_addr_spaces microblaze_1/Data] [get_bd_addr_segs axi_timer_1/S_AXI/Reg]
assign_bd_address -offset 0x43400000 -range 4K -target_address_space [get_bd_addr_spaces microblaze_1/Data] [get_bd_addr_segs mdm/S_AXI/Reg]
assign_bd_address -offset 0x44A00000 -range 64K -target_address_space [get_bd_addr_spaces microblaze_1/Data] [get_bd_addr_segs axi_perf_mon_1/S_AXI/Reg]
assign_bd_address -offset 0x70020000 -range 128K -target_address_space [get_bd_addr_spaces microblaze_1/Data] [get_bd_addr_segs kth_axi_Mesh_2D_Nostrum_2x2x1_0/S_AXI_1/reg0]
assign_bd_address -offset 0x00000000 -range 128K -target_address_space [get_bd_addr_spaces microblaze_1/Instruction] [get_bd_addr_segs microblaze_1_local_memory/ilmb_bram_if_cntlr/SLMB/Mem]
assign_bd_address -offset 0x00000000 -range 128K -target_address_space [get_bd_addr_spaces microblaze_2/Data] [get_bd_addr_segs microblaze_2_local_memory/dlmb_bram_if_cntlr/SLMB/Mem]
assign_bd_address -offset 0x40000000 -range 64K -target_address_space [get_bd_addr_spaces microblaze_2/Data] [get_bd_addr_segs axi_gpio_2/S_AXI/Reg]
assign_bd_address -offset 0x41200000 -range 64K -target_address_space [get_bd_addr_spaces microblaze_2/Data] [get_bd_addr_segs microblaze_2_axi_intc/S_AXI/Reg]
assign_bd_address -offset 0x41C00000 -range 64K -target_address_space [get_bd_addr_spaces microblaze_2/Data] [get_bd_addr_segs axi_pwm_pause_2/S_AXI/Reg]
assign_bd_address -offset 0x41C20000 -range 64K -target_address_space [get_bd_addr_spaces microblaze_2/Data] [get_bd_addr_segs axi_timer_2/S_AXI/Reg]
assign_bd_address -offset 0x43400000 -range 4K -target_address_space [get_bd_addr_spaces microblaze_2/Data] [get_bd_addr_segs mdm/S_AXI/Reg]
assign_bd_address -offset 0x44A10000 -range 64K -target_address_space [get_bd_addr_spaces microblaze_2/Data] [get_bd_addr_segs axi_perf_mon_2/S_AXI/Reg]
assign_bd_address -offset 0x70020000 -range 128K -target_address_space [get_bd_addr_spaces microblaze_2/Data] [get_bd_addr_segs kth_axi_Mesh_2D_Nostrum_2x2x1_0/S_AXI_2/reg0]
assign_bd_address -offset 0x00000000 -range 128K -target_address_space [get_bd_addr_spaces microblaze_2/Instruction] [get_bd_addr_segs microblaze_2_local_memory/ilmb_bram_if_cntlr/SLMB/Mem]
assign_bd_address -offset 0x00000000 -range 128K -target_address_space [get_bd_addr_spaces microblaze_3/Data] [get_bd_addr_segs microblaze_3_local_memory/dlmb_bram_if_cntlr/SLMB/Mem]
assign_bd_address -offset 0x40000000 -range 64K -target_address_space [get_bd_addr_spaces microblaze_3/Data] [get_bd_addr_segs axi_gpio_3/S_AXI/Reg]
assign_bd_address -offset 0x41200000 -range 64K -target_address_space [get_bd_addr_spaces microblaze_3/Data] [get_bd_addr_segs microblaze_3_axi_intc/S_AXI/Reg]
assign_bd_address -offset 0x41C00000 -range 64K -target_address_space [get_bd_addr_spaces microblaze_3/Data] [get_bd_addr_segs axi_pwm_pause_3/S_AXI/Reg]
assign_bd_address -offset 0x41C30000 -range 64K -target_address_space [get_bd_addr_spaces microblaze_3/Data] [get_bd_addr_segs axi_timer_3/S_AXI/Reg]
assign_bd_address -offset 0x43400000 -range 4K -target_address_space [get_bd_addr_spaces microblaze_3/Data] [get_bd_addr_segs mdm/S_AXI/Reg]
assign_bd_address -offset 0x44A20000 -range 64K -target_address_space [get_bd_addr_spaces microblaze_3/Data] [get_bd_addr_segs axi_perf_mon_3/S_AXI/Reg]
assign_bd_address -offset 0x70020000 -range 128K -target_address_space [get_bd_addr_spaces microblaze_3/Data] [get_bd_addr_segs kth_axi_Mesh_2D_Nostrum_2x2x1_0/S_AXI_3/reg0]
assign_bd_address -offset 0x00000000 -range 128K -target_address_space [get_bd_addr_spaces microblaze_3/Instruction] [get_bd_addr_segs microblaze_3_local_memory/ilmb_bram_if_cntlr/SLMB/Mem]
assign_bd_address -offset 0x42800000 -range 64K -target_address_space [get_bd_addr_spaces processing_system7_0/Data] [get_bd_addr_segs axi_timer_0/S_AXI/Reg]
assign_bd_address -offset 0x43400000 -range 4K -target_address_space [get_bd_addr_spaces processing_system7_0/Data] [get_bd_addr_segs mdm/S_AXI/Reg]
assign_bd_address -offset 0x43C00000 -range 64K -target_address_space [get_bd_addr_spaces processing_system7_0/Data] [get_bd_addr_segs axi_perf_mon_0/S_AXI/Reg]
assign_bd_address -offset 0x70020000 -range 128K -target_address_space [get_bd_addr_spaces processing_system7_0/Data] [get_bd_addr_segs kth_axi_Mesh_2D_Nostrum_2x2x1_0/S_AXI_0/reg0]

validate_bd_design
save_bd_design
